# Altium schematic sheet CAN收发器.SchDoc
size A4; SheetNumber: 6; SheetTotal: 7
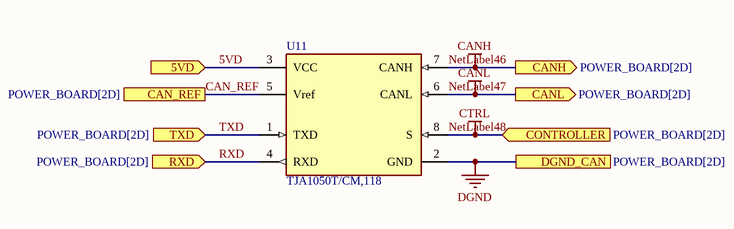
[diagram p0: CAN收发器.SchDoc]

## Parts
U11  TJA1050T/CM,118  [FP-SOT96-1-IPC_A]

## Ports
5VD (in, see POWER_BOARD[2D], 232收发器[2B]), CAN_REF (see POWER_BOARD[2D]), CANH (out, see POWER_BOARD[2D]), CANL (out, see POWER_BOARD[2D]), CONTROLLER (in, see POWER_BOARD[2D]), DGND_CAN (see POWER_BOARD[2D]), RXD (in, see POWER_BOARD[2D]), TXD (in, see POWER_BOARD[2D])

## Nets
DGND: U11.2(GND) ; port DGND_CAN
NetLabel46: U11.7(CANH) ; port CANH  [also labelled CANH]
NetLabel47: U11.6(CANL) ; port CANL  [also labelled CANL]
NetLabel48: U11.8(S) ; port CONTROLLER  [also labelled CTRL]
5VD: U11.3(VCC) ; port 5VD
CAN_REF: U11.5(Vref) ; port CAN_REF
RXD: U11.4(RXD) ; port RXD
TXD: U11.1(TXD) ; port TXD

## Library data of the parts
U11 = CMP-2000-04923-2: IC TRANSCEIVER HALF 1/1 8SO; Simplex/Duplex: Half Duplex; Max Supply Current: 10mA; Number of Receive Buffers: 1; Min Supply Voltage: 4.75V; Max Supply Voltage: 5.25V; Interface: CAN; Data Rate: 1Mbps; Receiver Hysteresis: 70mV; Number of Transmit Buffers: 1; Min Operating Temperature: -40°C; Case/Package: SO; REACH SVHC: No SVHC; Max Operating Temperature: 150°C; Number of Pins: 8; Lead Free: Lead Free; Number of Transceivers: 1; Packaging: Tape and Reel; Mount: Surface Mount; Radiation Hardening: No; Nominal Supply Current: 10mA; Package Quantity: 2500; Contact Plating: Gold